# EAGLE design H_Bridge_Motor_Driver_Circuit (EAGLE 8.2.2)
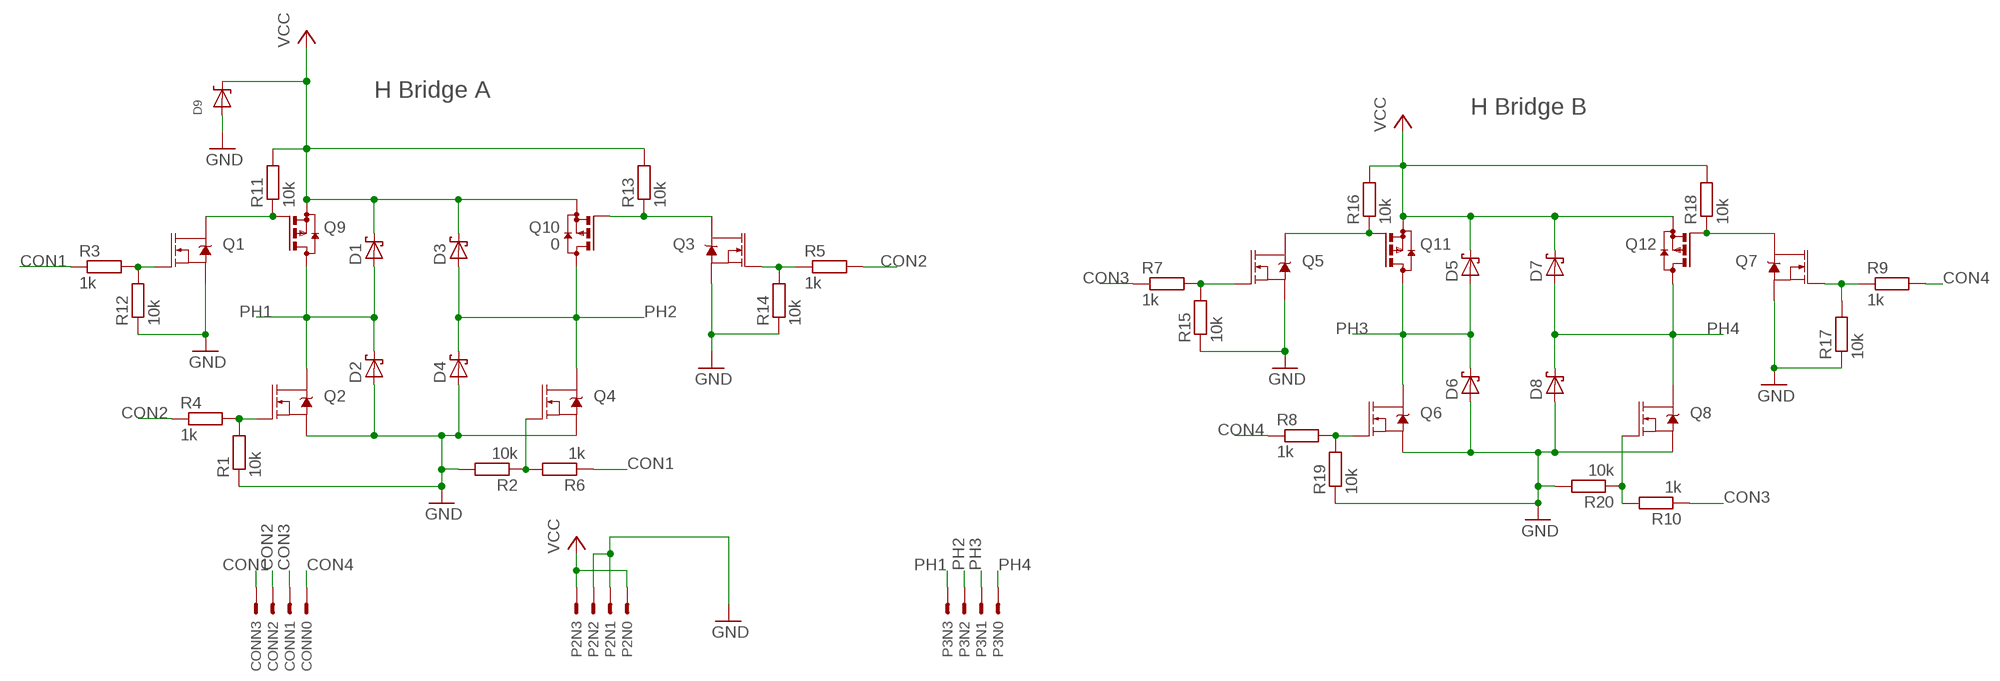
[diagram p0: schematic, sheet 1]

## Parts
CON  4PINHEADER  [4PINHEADER]
D1  BAS40  [SOT23]
D2  BAS40  [SOT23]
D3  BAS40  [SOT23]
D4  BAS40  [SOT23]
D5  BAS40  [SOT23]
D6  BAS40  [SOT23]
D7  BAS40  [SOT23]
D8  BAS40  [SOT23]
D9  DDZ5V6ASF  [DDZ5V6ASF]
P2  4PINHEADER  [4PINHEADER]
P3  4PINHEADER  [4PINHEADER]
Q1  MOSFET-NCH-BSS138  [SOT23-3]
Q2  MOSFET-NCH-BSS138  [SOT23-3]
Q3  MOSFET-NCH-BSS138  [SOT23-3]
Q4  MOSFET-NCH-BSS138  [SOT23-3]
Q5  MOSFET-NCH-BSS138  [SOT23-3]
Q6  MOSFET-NCH-BSS138  [SOT23-3]
Q7  MOSFET-NCH-BSS138  [SOT23-3]
Q8  MOSFET-NCH-BSS138  [SOT23-3]
Q9  BSS84  [SOT23]
Q10  0  BSS84  [SOT23]
Q11  BSS84  [SOT23]
Q12  BSS84  [SOT23]
R1  10k  R-EU_R1206  [R1206]
R2  10k  R-EU_R1206  [R1206]
R3  1k  R-EU_R1206  [R1206]
R4  1k  R-EU_R1206  [R1206]
R5  1k  R-EU_R1206  [R1206]
R6  1k  R-EU_R1206  [R1206]
R7  1k  R-EU_R1206  [R1206]
R8  1k  R-EU_R1206  [R1206]
R9  1k  R-EU_R1206  [R1206]
R10  1k  R-EU_R1206  [R1206]
R11  10k  R-EU_R1206  [R1206]
R12  10k  R-EU_R1206  [R1206]
R13  10k  R-EU_R1206  [R1206]
R14  10k  R-EU_R1206  [R1206]
R15  10k  R-EU_R1206  [R1206]
R16  10k  R-EU_R1206  [R1206]
R17  10k  R-EU_R1206  [R1206]
R18  10k  R-EU_R1206  [R1206]
R19  10k  R-EU_R1206  [R1206]
R20  10k  R-EU_R1206  [R1206]

## Nets
CON1: CON.N3 R3.1 R6.1
CON2: CON.N2 R4.1 R5.2
CON3: CON.N1 R7.1 R10.1
CON4: CON.N0 R8.1 R9.2
GND: D2.1(A) D4.1(A) D6.1(A) D8.1(A) D9.P$1(A) P2.N1 P2.N2 Q1.2(S) Q2.2(S) Q3.2(S) Q4.2(S) Q5.2(S) Q6.2(S) Q7.2(S) Q8.2(S) R1.1 R2.2 R12.1 R14.1 R15.1 R17.1 R19.1 R20.2
N$1: Q1.3(D) Q9.1(G) R11.1
N$2: Q1.1(G) R3.2 R12.2
N$3: Q3.3(D) Q10.1(G) R13.1
N$4: Q3.1(G) R5.1 R14.2
N$5: Q4.1(G) R2.1 R6.2
N$6: Q5.3(D) Q11.1(G) R16.1
N$7: Q8.1(G) R10.2 R20.1
N$8: Q5.1(G) R7.2 R15.2
N$9: Q2.1(G) R1.2 R4.2
N$10: Q7.3(D) Q12.1(G) R18.1
N$11: Q7.1(G) R9.1 R17.2
N$12: Q6.1(G) R8.2 R19.2
PH1: D1.1(A) D2.3(C) P3.N3 Q2.3(D) Q9.3(D)
PH2: D3.1(A) D4.3(C) P3.N2 Q4.3(D) Q10.3(D)
PH3: D5.1(A) D6.3(C) P3.N1 Q6.3(D) Q11.3(D)
PH4: D7.1(A) D8.3(C) P3.N0 Q8.3(D) Q12.3(D)
VCC: D1.3(C) D3.3(C) D5.3(C) D7.3(C) D9.P$2(C) P2.N0 P2.N3 Q9.2(S) Q10.2(S) Q11.2(S) Q12.2(S) R11.2 R13.2 R16.2 R18.2

## Notes on the sheet
- H Bridge A
- H Bridge B

## Library data of the parts
CON P2 P3 = ForceTronics:4PINHEADER
D1-D8 = diode:BAS40: Silicon Schottky Diodes General-purpose diode for high-speed switching
D9 = ForceTronics:DDZ5V6ASF: DDZ5V6ASF 5.42 Zener Diode
Q1-Q8 = SparkFun-DiscreteSemi:MOSFET-NCH: N-channel MOSFETs Voltage controlled devices that allow control of high current outputs. SparkFun Products: SparkFun OpenScale <â€https://www.sparkfun.com/products/13261â€> SparkFun Digital Sandbox <â€https://www.sparkfun.com/products/12651â€> SparkFun Monster Moto Shield <â€https://www.sparkfun.com/products/10182â€> SparkFun MOSFET Power Controller <â€https://www.sparkfun.com/products/11214â€>; PROD_ID: TRANS-00830; VALUE: 220mA/50V/3.5Î©
Q9-Q12 = transistor-small-signal:BSS84: P-CHANNEL MOS FET
R1-R20 = rcl:R-EU_: RESISTOR, European symbol

## Board
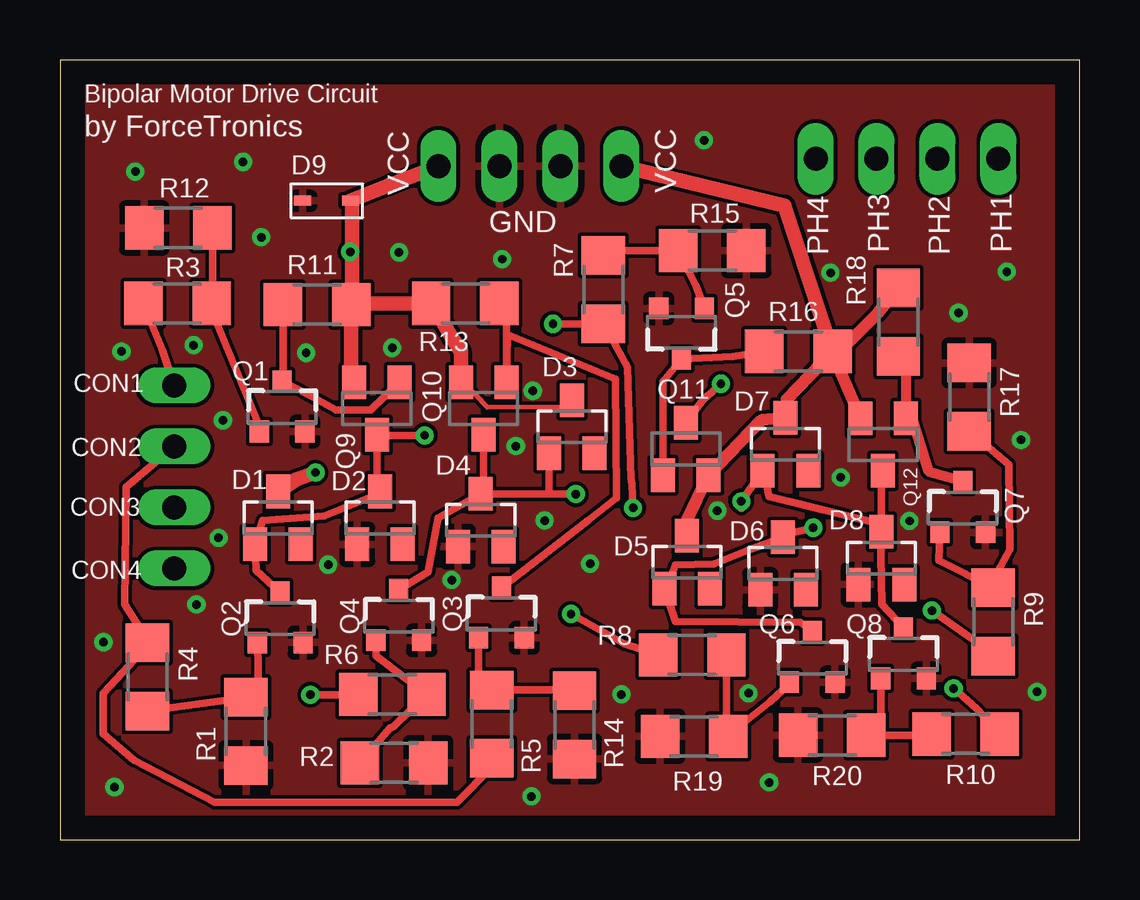
[diagram p1: board, top side]
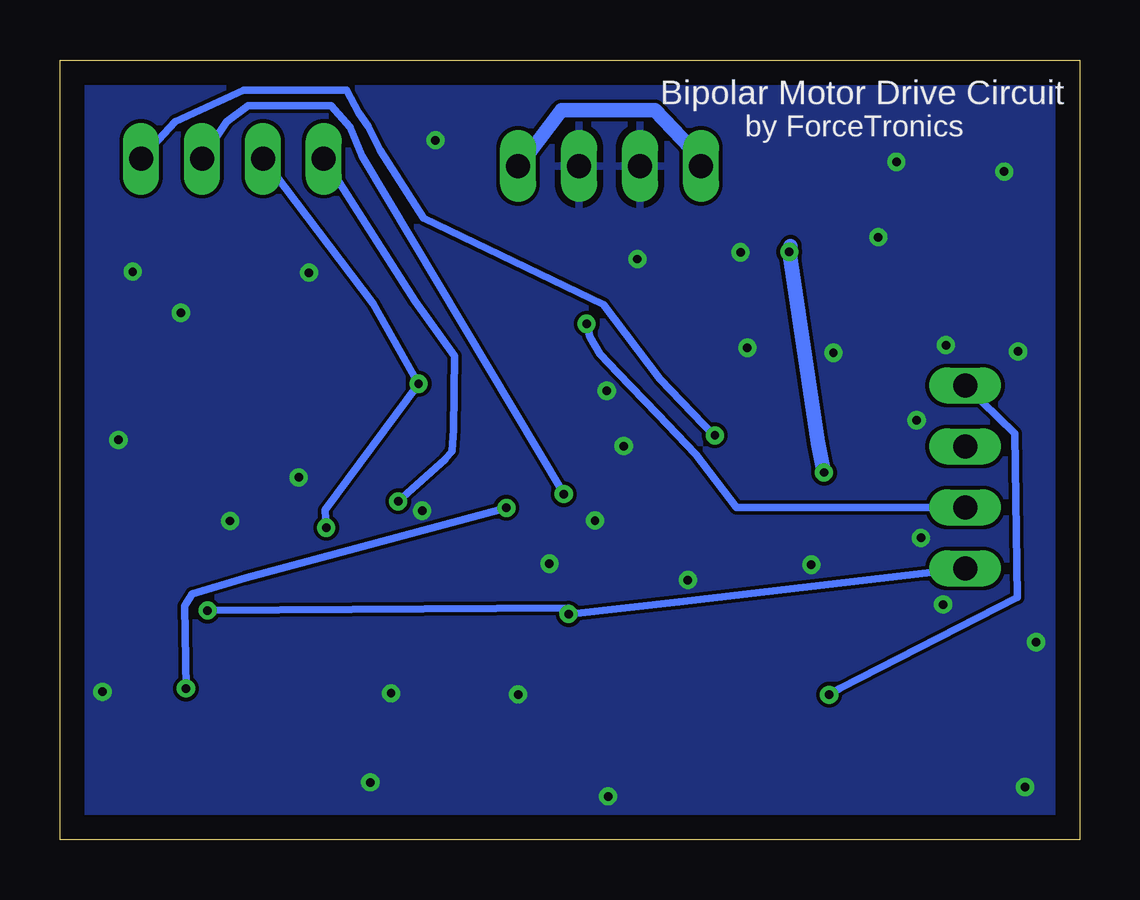
[diagram p2: board, bottom side, seen from below]

Size 42.5 x 32.5 mm. Coordinates in mm from the lower left corner, seen from the top.
Outline: 0,0 42.5,0 42.5,32.5 0,32.5 0,0
Copper layers (1*16): Top 0.035mm / dielectric 1.5mm / Bottom 0.035mm
Design rules "default": minimum track width 6mil, minimum drill 0.35mm, track to track 6mil, track to pad 6mil, pad to pad 6mil, via to via 6mil, smd to smd 6mil, copper to edge 40mil, drill to drill 6mil, minimum pad ring 10mil, minimum via ring 8mil, stop-mask expansion 4mil, vias tented up to drill 0mil, thermal gap 10mil

### Footprints (pad centres in the part's own frame; a part is rotated, then mirrored left to right if it is on the bottom)
4PINHEADER = drill 1 long: N0 -3.81,0; N1 -1.27,0; N2 1.27,0; N3 3.81,0
SOT23 = smd 1 x 1.4: 1 -0.95,-1.1; 2 0.95,-1.1; 3 0,1.1
DDZ5V6ASF = smd 0.71 x 0.41: P$1 0,0; P$2 1.99,0
SOT23-3 = smd 0.8 x 0.9: 1 -0.95,-1; 2 0.95,-1; 3 0,1.1
R1206 = smd 1.6 x 1.803: 1 -1.422,0; 2 1.422,0

### Placement (x,y rotation side)
CON  4.77,15.12 90 top
D1  9.09,13.41 0 top
D2  13.34,13.41 0 top
D3  21.34,17.21 0 top
D4  17.54,13.31 0 top
D5  26.14,11.56 0 top
D6  30.14,11.51 0 top
D7  30.24,16.48 0 top
D8  34.24,11.73 0 top
D9  10.12,26.63 0 top
P2  19.59,28.08 0 top
P3  35.31,28.38 0 top
Q1  9.26,18.01 0 top
Q2  9.18,9.21 0 top
Q3  18.4,9.41 0 top
Q4  14.12,9.31 0 top
Q5  25.91,21.14 180 top
Q6  31.36,7.56 0 top
Q7  37.63,13.81 0 top
Q8  35.16,7.72 0 top
Q9  13.21,17.97 180 top
Q10  17.66,17.97 180 top
Q11  26.09,16.28 0 top
Q12  34.31,16.47 180 top
R1  7.75,4.51 90 top
R2  13.93,3.2 0 top
R3  4.9,22.35 0 top
R4  3.65,6.78 270 top
R5  18,4.81 270 top
R6  13.86,6.05 0 top
R7  22.65,22.93 90 top
R8  26.36,7.7 0 top
R9  38.9,9.07 270 top
R10  37.75,4.4 180 top
R11  10.72,22.3 0 top
R12  4.94,25.5 0 top
R13  16.89,22.35 180 top
R14  21.45,4.78 90 top
R15  27.19,24.55 180 top
R16  30.78,20.35 0 top
R17  37.9,18.45 270 top
R18  34.95,21.57 90 top
R19  26.44,4.3 0 top
R20  32.19,4.35 180 top

### Tracks (layer width: path | path; a pad name or v marks a point on that pad's centre or on a via)
CON1  (via drill 0.35)
  Top 0.305: CON.N3 4.25,20.43 R3.1 | v10.44,6.04 12.54,6.04 R6.1
  Bottom 0.305: CON.N3 2.7,16.93 2.6,10.1 10,6.3 v10.44,6.04 10.44,6 10.5,6
CON2
  Top 0.305: CON.N2 2.75,14.69 2.7,9.8 3.65,8.3 R4.1 3.65,8.1 1.8,6.1 1.8,4.4 3.1,3.3 6.45,1.55 16.55,1.55 18,3.04 R5.2
CON3  (via drill 0.35)
  Top 0.305: v20.55,21.5 R7.1 23.65,19.71 23.81,15.06 23.84,14.83 v23.89,13.83 | v37.25,6.3 38.22,5.45 R10.1
  Bottom 0.305: CON.N1 14.3,13.85 16,16.05 17.6,17.75 19.25,19.45 20,20.24 20.4,20.94 v20.55,21.5 | v23.89,13.83 34.76,10.9 37,10.25 37.3,9.75 v37.25,6.3 37.25,6.25
CON4  (via drill 0.35)
  Top 0.305: v21.3,9.4 23.54,8.15 R8.1 | R9.2 37.9,8.45 v36.35,9.55
  Bottom 0.305: CON.N0 16.7,9.91 21.15,9.4 21.3,9.25 v21.3,9.4 21.3,9.65 v36.35,9.55
GND  (via drill 0.35)
  other vias: 32.55,15.1 27.4,13.71 28.7,6.1 23.4,6.05 22.1,11.5 20.2,13.3 19,16.4 13.85,20.5 19.71,18.71 6.61,12.58 6.79,17.48 1.81,8.23 7.63,28.25 14.13,24.48 18.43,24.2 26.85,29.15 32.12,23.63 37.46,21.96 40.06,16.66 40.73,6.16 29.56,2.38 19.65,1.8 11.18,11.46 16.33,10.82 5.57,20.61 35.41,13.28 8.39,25.11 2.56,20.35 3.14,27.85 39.47,23.67 10.26,20.29 5.69,9.8 2.27,2.19
  pour Top: -1,36 -1,-1 50,-1 50,36
  pour Bottom: -1,-1 -1,36 50,36 50,-1
N$1
  Top 0.305: R11.1 9.3,19.11 Q1.3 10.35,18.56 11.5,17.9 12.94,17.9 Q9.1
N$2
  Top 0.305: 6.36,22.35 R3.2 | 6.36,22.35 R12.2 | Q1.1 8.2,17.51 6.5,21.6 6.36,22.2 6.36,22.35
N$3
  Top 0.305: R13.1 18.61,22.35 Q10.1 18.66,21.05 23.15,19.2 23.2,14.25 22,13.3 19.2,11.11 Q3.3
N$4
  Top 0.305: Q3.1 17.45,5.88 R5.1 21.45,6.23 R14.2
N$5
  Top 0.305: Q4.1 13.17,7.65 R6.2 13.88,4.7 13.75,4.65 13.15,3.95 R2.1
N$6
  Top 0.305: R16.1 28.06,20.14 Q5.3 25.14,19.09 Q11.1
N$7
  Top 0.305: R10.2 36.33,4.35 R20.1 34.21,4.35 Q8.1
N$8
  Top 0.305: Q5.1 26.52,23.09 R15.2 22.65,24.55 R7.2
N$9
  Top 0.305: R4.2 7.35,5.86 R1.2 8.28,5.93 Q2.1
N$10
  Top 0.406: R18.1 35.26,20.15 Q12.1 35.5,17.57 36.2,15.35 37.63,14.95 Q7.3
N$11
  Top 0.305: R17.2 39.55,15.63 39.6,12.1 38.7,10.45 R9.1 36.63,11.64 Q7.1
N$12
  Top 0.305: Q6.1 30.41,6.5 29.6,5.75 28.55,4.9 R19.2 27.78,4.3 R8.2
PH1  (via drill 0.35)
  Top 0.305: 13.21,16.85 13.21,14.51 D2.3 13,14.31 11,13.5 8.44,13.3 D1.1 8.18,11.21 Q2.3 | 13.21,16.85 Q9.3 | v15.2,16.85 13.21,16.85
  Bottom 0.305: P3.N3 37.7,29.93 34.85,31.25 30.55,31.25 30.05,30.3 29.65,29.75 29.15,28.75 27.35,25.9 19.85,22.3 17.5,19.2 15.25,16.85 v15.2,16.85
PH2  (via drill 0.35)
  Top 0.305: Q4.3 15.35,11.16 15.75,13.4 D4.3 | 20.39,14.41 D4.3 | 20.39,14.41 D3.1 | D4.3 17.66,14.41 Q10.3 | v21.5,14.4 20.34,14.4 20.39,14.41
  Bottom 0.305: P3.N2 35.55,29.93 34.65,30.6 31.2,30.6 30.4,29.7 29.9,28.5 v21.5,14.4 21.4,14.4
PH3  (via drill 0.35)
  Top 0.305: Q11.3 26.8,18.33 v27.55,19 | Q6.3 30.86,9.05 25.65,9.1 D5.1 25.25,10.46 25.65,11.45 27.25,11.5 28.65,12.05 D6.3 30.14,12.7 v31.4,13
  Bottom 0.305: P3.N1 29.44,22.35 v27.55,19 31.45,13.75 v31.4,13 31.35,13.05
PH4  (via drill 0.35)
  Top 0.305: 34.23,12.89 34.19,13.15 29.55,14.3 29.35,15.38 D7.1 28.9,14.83 v28.4,14.1 28.4,13.8 | 34.23,12.89 D8.3 34.2,12.83 34.25,9.8 35.16,8.85 Q8.3 | Q12.3 34.23,15.37 34.23,12.89
  Bottom 0.305: v28.4,14.1 26.45,15.85 26.15,16.2 26.1,17.1 26.05,20.15 27.7,22.45 P3.N0
VCC  (via drill 0.35)
  Top 0.203: Q10.2 16.8,19.07 17.81,18.03 21.34,18.05 D3.3
  Top 0.305: Q9.2 12.14,19.07 | 12.14,22.13 R11.2
  Top 0.508: D5.3 26.14,13.31 Q11.2 29.24,17.48 D7.3 30.29,18.35 R16.2 32.29,20.14 | 32.29,20.14 32.56,19.45 Q12.2 | R18.2 34.09,21.94 32.29,20.14
  Top 0.61: 12.14,19.07 12.14,22.13 12.14,22.35 12.18,22.35 | 12.18,22.35 R13.2 15.5,22.35 16.35,20.9 16.71,20.35 Q10.2 | D1.3 9.85,15.01 v10.65,15.3 | 12.18,24.5 v12.1,24.5 | 12.18,24.5 12.18,22.35 | P2.N3 30.2,26.43 R16.2 | P2.N0 13.71,27.28 D9.P$2 12.18,26.63 12.18,24.5
  Bottom 0.61: v10.65,15.3 10.9,16.55 v12.1,24.5 12.05,24.75 | P2.N3 23.1,28.43 21.6,30.4 17.7,30.4 15.85,28.45 15.78,28.05 P2.N0

### Text on the board
tNames: Bipolar Motor Drive Circuit | by ForceTronics | VCC | VCC | GND | PH4 | PH3 | PH2 | PH1 | CON1 | CON2 | CON3 | CON4
bNames: Bipolar Motor Drive Circuit | by ForceTronics